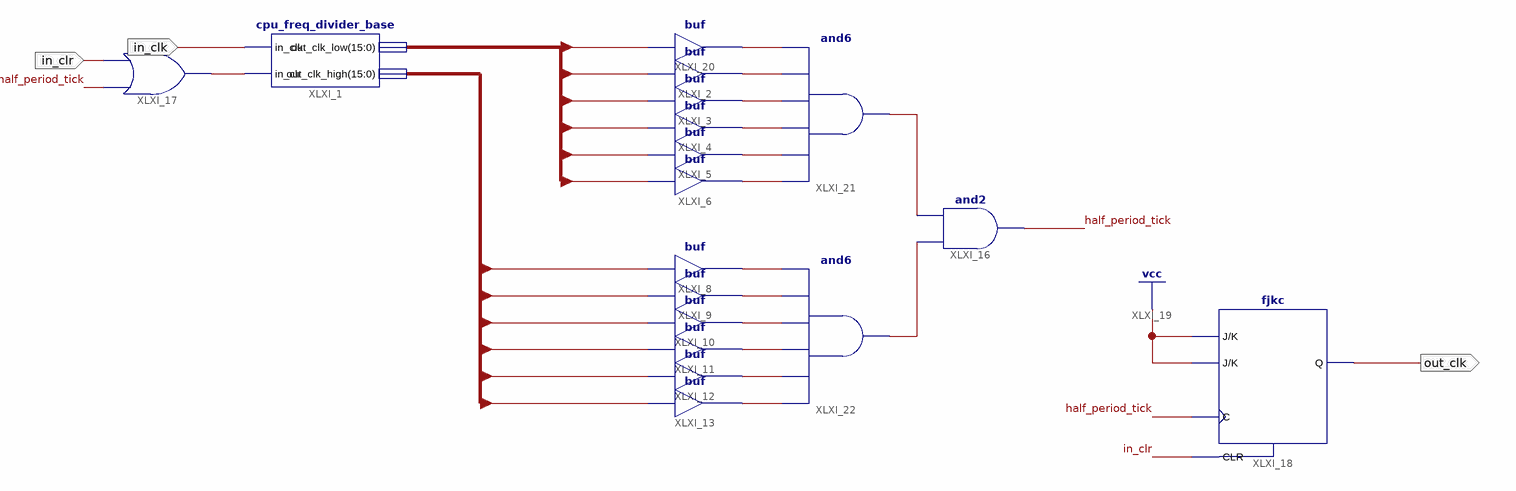
[diagram p0: schematic sheet 1]
// Xilinx ISE schematic cpu_freq_divider_1Stg.sch (aspartan6) as structural Verilog: 18 symbols, 3 ports
module cpu_freq_divider_1Stg (
  input  in_clk,
  input  in_clr,
  output out_clk
);

  wire half_period_tick, XLXN_3, XLXN_4, XLXN_5, XLXN_6, XLXN_7, XLXN_10, XLXN_26, XLXN_27, XLXN_29, XLXN_30,
       XLXN_31, XLXN_34, XLXN_35, XLXN_37, XLXN_43;
  wire [15:0] high, low;

  cpu_freq_divider_base XLXI_1 (.in_clk(in_clk), .in_clr(XLXN_37), .out_clk_high(high), .out_clk_low(low));
  buf XLXI_2 (XLXN_3, low[10]);
  buf XLXI_3 (XLXN_4, low[9]);
  buf XLXI_4 (XLXN_5, low[8]);
  buf XLXI_5 (XLXN_6, low[7]);
  buf XLXI_6 (XLXN_7, low[2]);
  buf XLXI_8 (XLXN_10, high[0]);
  buf XLXI_9 (XLXN_26, high[1]);
  buf XLXI_10 (XLXN_27, high[2]);
  buf XLXI_11 (XLXN_29, high[3]);
  buf XLXI_12 (XLXN_30, high[4]);
  buf XLXI_13 (XLXN_31, high[6]);
  and XLXI_16 (half_period_tick, XLXN_35, XLXN_34);
  or XLXI_17 (XLXN_37, half_period_tick, in_clr);
  fjkc XLXI_18 (.C(half_period_tick), .CLR(in_clr), .J(1'b1), .K(1'b1), .Q(out_clk));
  buf XLXI_20 (XLXN_43, low[14]);
  and XLXI_21 (XLXN_34, XLXN_7, XLXN_6, XLXN_5, XLXN_4, XLXN_3, XLXN_43);
  and XLXI_22 (XLXN_35, XLXN_31, XLXN_30, XLXN_29, XLXN_27, XLXN_26, XLXN_10);
endmodule
